# EAGLE design chlorophyll_analyzer_spectorometer (EAGLE 9.4.2)
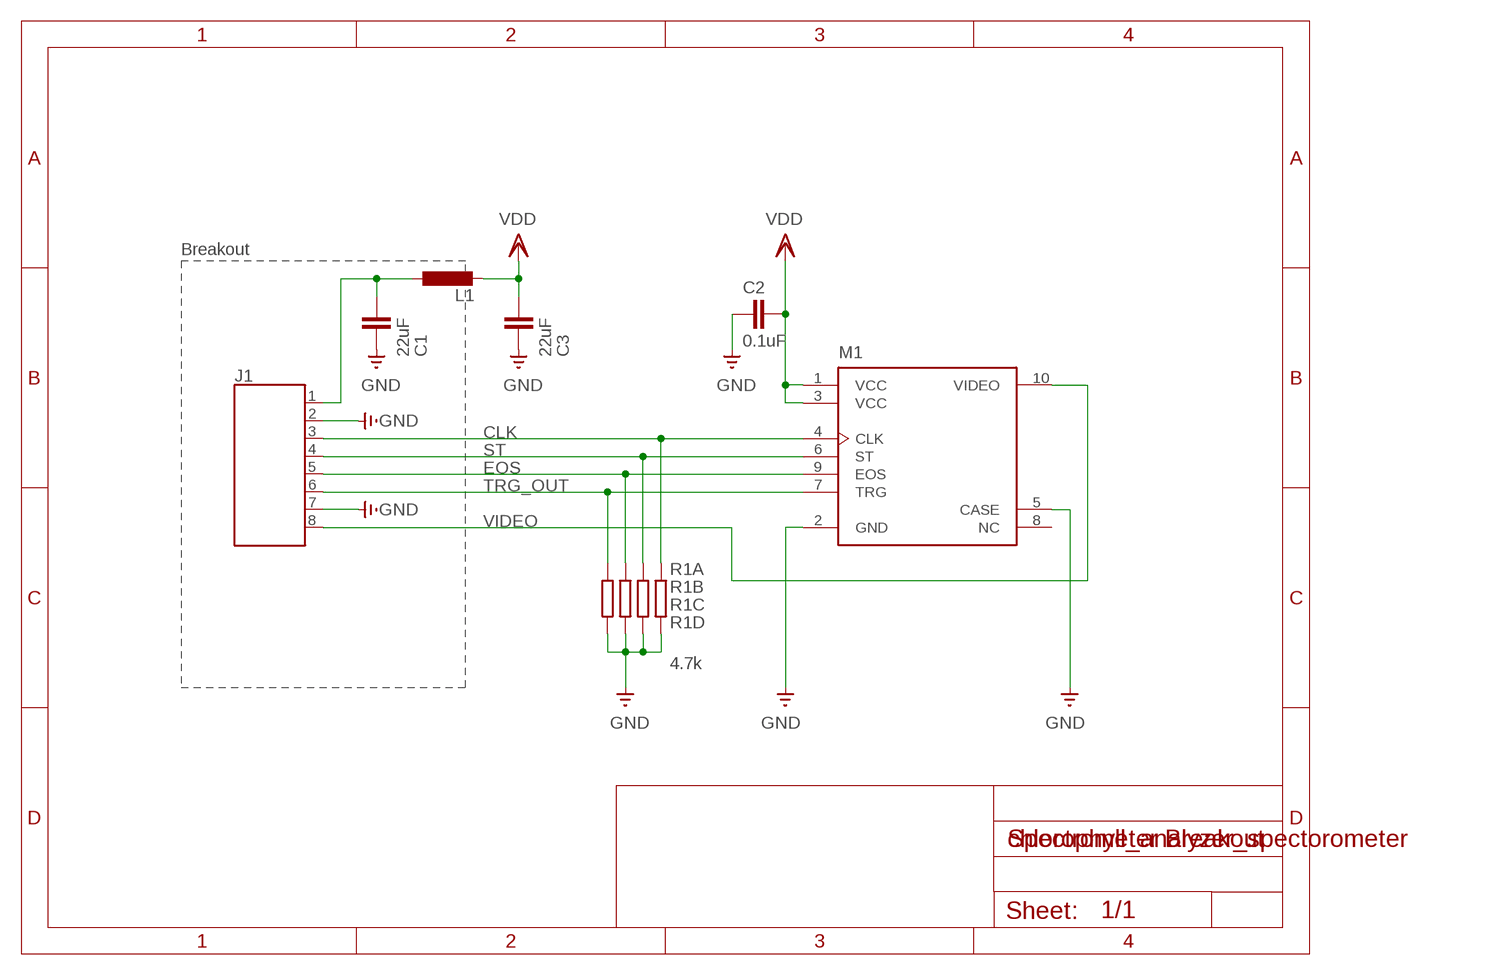
[diagram p0: schematic, sheet 1]

## Parts
C1  22uF  C-EUC0603K  [C0603K]
C2  0.1uF  C-EUC0603K  [C0603K]
C3  22uF  C-EUC0603K  [C0603K]
J1  687108183722  [687108183722]
L1  INDUCOR1608  [SMD1608]
M1  C12880MA  [C12880MA]
R1  4.7k  RESISTOR_ARRY1206  [RESCAXS80P320X160X60-8N]

## Nets
CLK: J1.3 M1.4(CLK) R1.5
EOS: J1.5 M1.9(EOS) R1.7
GND: C1.2 C2.2 C3.2 J1.2 J1.7 M1.2(GND) M1.5(CASE) R1.1 R1.2 R1.3 R1.4
N$1: C1.1 J1.1 L1.1
ST: J1.4 M1.6(ST) R1.6
TRG_OUT: J1.6 M1.7(TRG) R1.8
VDD: C2.1 C3.1 L1.2 M1.1(VCC) M1.3(VCC)
VIDEO: J1.8 M1.10(VIDEO)
Unconnected: M1.8(NC)

## Notes on the sheet
- Breakout
- Spectrometer Breakout

## Library data of the parts
C1-C3 = rcl:C-EU: CAPACITOR, European symbol; SPICEPREFIX: C
J1 = Eagle_FPC_CONNECTOR_AND_FFC_CAB (rev18c):687108183722: 687108183722 WR-FPC 0.50mm SMT Horizontal Bottom Contact - Low Profile <http://katalog.we-online.de/media/images/v2/Family_WR-FPC_6871xx183722.jpg> Details see: http://katalog.we-online.de/en/em/FPC_0_5_SMT_ZIF_HORIZONTAL_BOTTOM_CONTACT_LOW_PROFILE_6871xx183722 Created by Yingchun,shan 2016 (C) Wurth Elektronik
L1 = Fugu_RCL:INDUCOR
M1 = C12880MA:C12880MA: Mini Spectrometer
R1 = Fugu_RCL:RESISTOR_ARRY

## Board
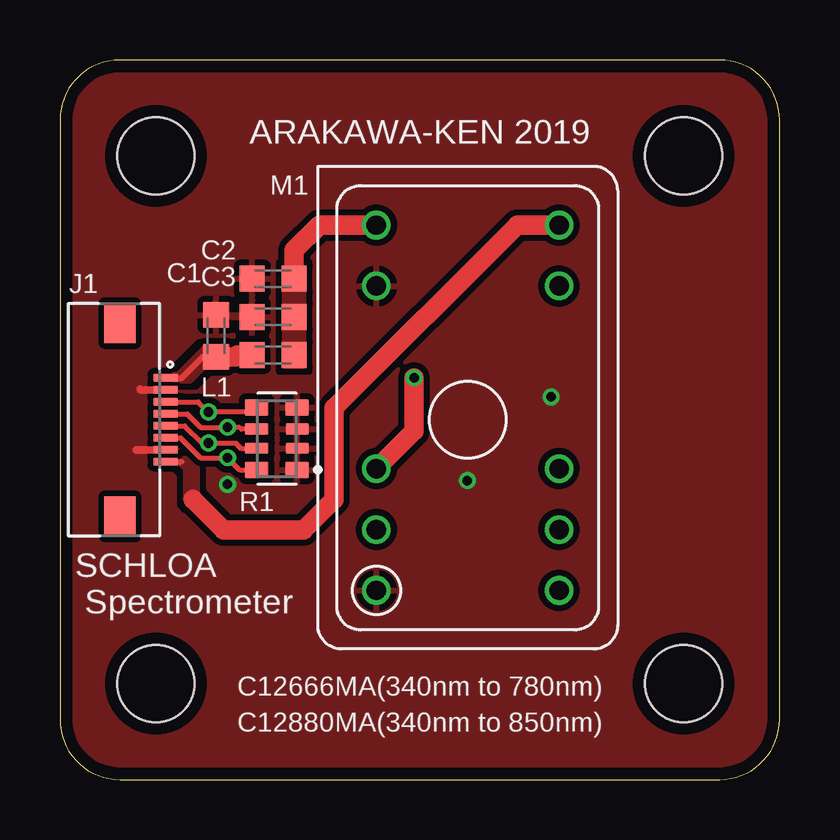
[diagram p1: board, top side]
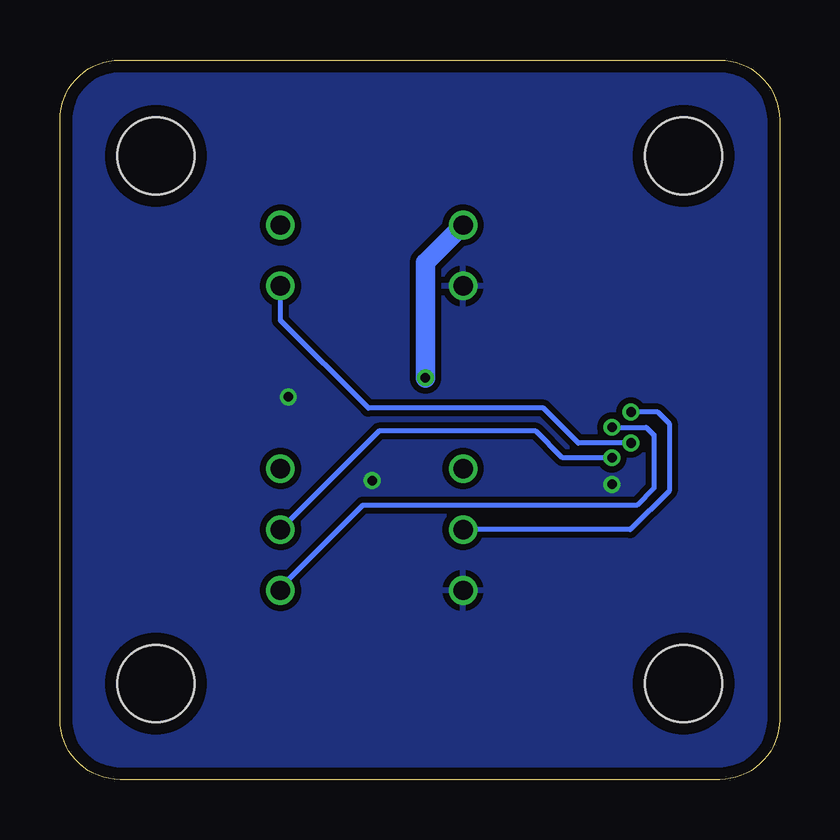
[diagram p2: board, bottom side, seen from below]

Size 30 x 30 mm. Coordinates in mm from the lower left corner, seen from the top.
Outline: 0,27.5 0,2.5 arc90 2.5,0 27.5,0 arc90 30,2.5 30,27.5 arc90 27.5,30 2.5,30 arc90 0,27.5
Copper layers (1*16): Top 0.035mm / dielectric 1.6mm / Bottom 0.035mm
Design rules "Elecrow_2-layer_PCB_eagle_rule": minimum track width 6mil, minimum drill 12mil, track to track 6mil, track to pad 6mil, pad to pad 6mil, via to via 8mil, smd to smd 0mil, copper to edge 20mil, drill to drill 10mil, minimum pad ring 6mil, minimum via ring 6mil, stop-mask expansion 0mil, vias tented up to drill 100mil, thermal gap 10mil
Holes 3.2 mm at 4,26 4,4 26,26 26,4

### Footprints (pad centres in the part's own frame; a part is rotated, then mirrored left to right if it is on the bottom)
C0603K = smd 1.05 x 1.08: 1 -0.875,0; 2 0.875,0
687108183722 = smd 0.3 x 1: 1 -1.75,1.9; 2 -1.25,1.9; 3 -0.75,1.9; 4 -0.25,1.9; 5 0.25,1.9; 6 0.75,1.9; 7 1.25,1.9; 8 1.75,1.9 | smd 1.65 x 1.3: Z1 -4.025,0; Z2 4.025,0
SMD1608 = smd 1.05 x 1.08: 1 -0.875,0; 2 0.875,0
C12880MA = drill 0.8: 1 -3.81,7.62; 2 -3.81,5.08; 3 -3.81,-2.54; 4 -3.81,-5.08; 5 -3.81,-7.62; 6 3.81,-7.62; 7 3.81,-5.08; 8 3.81,-2.54; 9 3.81,5.08; 10 3.81,7.62
RESCAXS80P320X160X60-8N = smd 0.98 x 0.68: 1 -0.845,1.3; 4 -0.845,-1.3; 5 0.845,-1.3; 8 0.845,1.3 | smd 0.98 x 0.48: 2 -0.845,0.4; 3 -0.845,-0.4; 6 0.845,-0.4; 7 0.845,0.4

### Placement (x,y rotation side)
C1  6.51,18.5 90 top
C2  8.89,20.88 180 top
C3  8.89,19.29 180 top
J1  2.5,15 270 top
L1  8.89,17.7 0 top
M1  17,15.5 0 top
R1  9.05,14.21 180 top

### Tracks (layer width: path | path; a pad name or v marks a point on that pad's centre or on a via)
CLK  (via drill 0.4)
  Top 0.203: R1.5 8.02,15.32 v6.19,15.32 5.76,15.75 J1.3
  Bottom 0.203: v6.19,15.32 5.08,15.32 4.6,14.84 4.6,12.04 6.22,10.42 M1.4
EOS  (via drill 0.4)
  Top 0.203: R1.7 7.54,13.81 7.32,14.03 v6.19,14.03 5.92,14.03 5.2,14.75 J1.5
  Bottom 0.203: v6.19,14.03 8.39,14.03 9.84,15.48 17.14,15.48 20.81,19.15 M1.9
GND  (via drill 0.4)
  Top 0.305: J1.2 3.36,16.25 3.33,16.27 | J1.7 3.19,13.75 3.17,13.73
  other vias: 6.99,12.3 16.99,12.46 20.48,15.96
  pour Top (isolate 0.254, rank 2): -2,32 32,32 32,-2 -2,-2
  pour Bottom (isolate 0.254, rank 2): -4,34 34,34 34,-4 -4,-4
N$1
  Top 0.254: J1.1 5.08,16.75 5.95,17.62 C1.1
  Top 0.813: C1.1 7.3,17.62 7.38,17.7 L1.1
  pour Top (no thermals): 4.76,16.91 4.92,16.91 6.03,18.02 6.51,18.02 6.51,17.23 6.03,17.23 5.4,16.59 4.76,16.59
ST  (via drill 0.4)
  Top 0.203: R1.6 7.56,14.61 7.49,14.69 v6.99,14.69 5.87,14.69 5.31,15.25 J1.4
  Bottom 0.203: v6.99,14.69 5.56,14.69 5.24,14.37 5.24,12.15 5.95,11.43 17.38,11.43 20.81,8 M1.6
TRG_OUT  (via drill 0.4)
  Top 0.203: R1.8 7.49,12.91 v6.99,13.42 5.87,13.42 5.04,14.25 J1.6
  Bottom 0.203: v6.99,13.42 9.05,13.42 10.16,14.53 16.7,14.53 M1.7
VDD  (via drill 0.4)
  Top 0.813: C2.1 9.77,22.07 10.81,23.12 M1.1 | v14.76,16.75 14.76,14.53 M1.3
  Bottom 0.813: v14.76,16.75 14.76,21.55 M1.1
  pour Top (isolate 0.254, no thermals): 9.37,17.23 9.37,21.35 10.16,21.35 10.16,17.23
VIDEO
  Top 0.152: 5.08,13.26 5,13.18
  Top 0.203: J1.8 4.45,13.26 5.08,13.26
  Top 0.813: 5.56,11.67 6.83,10.4 10.16,10.4 11.43,11.67 11.43,15.48 19.07,23.12 M1.10
  pour Top (isolate 0.254, no thermals): 4.45,13.42 5.4,13.42 5.71,13.1 5.71,11.83 5.79,11.75 5.48,11.43 5.24,11.67 5.24,12.94 4.92,13.26 4.45,13.26

### Text on the board
tPlace: ARAKAWA-KEN 2019 | SCHLOA / Spectrometer
tNames: C12666MA(340nm to 780nm) | C12880MA(340nm to 850nm)